# EAGLE design jetson_board (EAGLE 9.5.2)
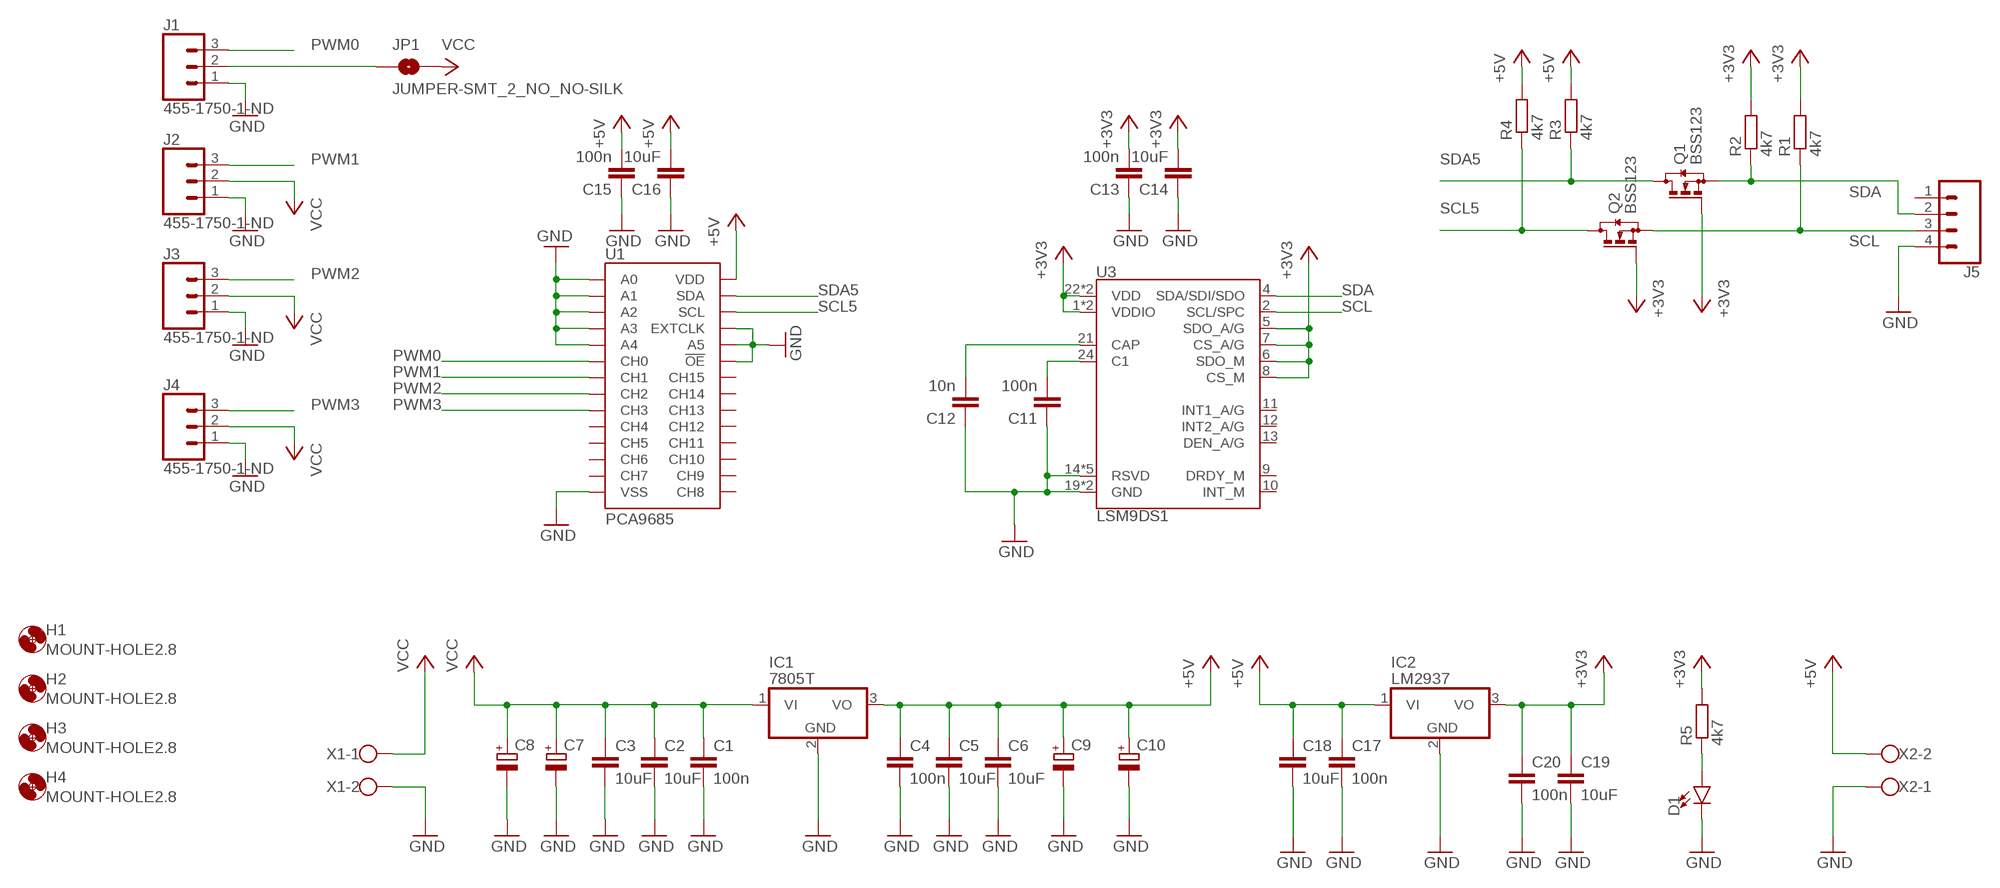
[diagram p0: schematic, sheet 1]

## Parts
C1  100n  C-EUC0805  [C0805]
C2  10uF  C-EUC0805  [C0805]
C3  10uF  C-EUC0805  [C0805]
C4  100n  C-EUC0805  [C0805]
C5  10uF  C-EUC0805  [C0805]
C6  10uF  C-EUC0805  [C0805]
C7  CPOL-EUUD-8X10  [UD-8X10_NICHICON]
C8  CPOL-EUUD-8X10  [UD-8X10_NICHICON]
C9  CPOL-EUUD-8X10  [UD-8X10_NICHICON]
C10  CPOL-EUUD-8X10  [UD-8X10_NICHICON]
C11  100n  C-EUC0805  [C0805]
C12  10n  C-EUC0805  [C0805]
C13  100n  C-EUC0805  [C0805]
C14  10uF  C-EUC0805  [C0805]
C15  100n  C-EUC0805  [C0805]
C16  10uF  C-EUC0805  [C0805]
C17  100n  C-EUC0805  [C0805]
C18  10uF  C-EUC0805  [C0805]
C19  10uF  C-EUC0805  [C0805]
C20  100n  C-EUC0805  [C0805]
D1  LED1206  [LED-1206]
H1  MOUNT-HOLE2.8  [2,8]
H2  MOUNT-HOLE2.8  [2,8]
H3  MOUNT-HOLE2.8  [2,8]
H4  MOUNT-HOLE2.8  [2,8]
IC1  7805T  [TO220H]
IC2  LM2937  [TO263-3]
J1  455-1750-1-ND  CONN_03  [1X03]
J2  455-1750-1-ND  CONN_03  [1X03]
J3  455-1750-1-ND  CONN_03  [1X03]
J4  455-1750-1-ND  CONN_03  [1X03]
J5  CONN_04LONGPADS  [1X04_LONGPADS]
JP1  JUMPER-SMT_2_NO_NO-SILK  [SMT-JUMPER_2_NO_NO-SILK]
Q1  BSS123  [SOT23]
Q2  BSS123  [SOT23]
R1  4k7  R-EU_R0805  [R0805]
R2  4k7  R-EU_R0805  [R0805]
R3  4k7  R-EU_R0805  [R0805]
R4  4k7  R-EU_R0805  [R0805]
R5  4k7  R-EU_R0805  [R0805]
U1  PCA9685  [TSSOP-28_4MM]
U3  LSM9DS1  [LGA-24-3.5X3]
X1  W237-102  [W237-102]
X2  W237-102  [W237-102]

## Nets
+3V3: C13.2 C14.2 C19.1 C20.1 IC2.3(VO) Q1.1(G) Q2.1(G) R1.2 R2.2 R5.2 U3.1(VDDIO) U3.3(VDDIO) U3.5(SDO_A/G) U3.6(SDO_M) U3.7(CS_A/G) U3.8(CS_M) U3.22(VDD) U3.23(VDD)
+5V: C4.1 C5.1 C6.1 C9.+ C10.+ C15.2 C16.2 C17.1 C18.1 IC1.3(VO) IC2.1(VI) R3.2 R4.2 U1.28(VDD) X2.2
GND: C1.2 C2.2 C3.2 C4.2 C5.2 C6.2 C7.- C8.- C9.- C10.- C11.1 C12.1 C13.1 C14.1 C15.1 C16.1 C17.2 C18.2 C19.2 C20.2 D1.C IC1.2(GND) IC2.2(GND) J1.1 J2.1 J3.1 J4.1 J5.4 U1.1(A0) U1.2(A1) U1.3(A2) U1.4(A3) U1.5(A4) U1.14(VSS) U1.23(!OE) U1.24(A5) U1.25(EXTCLK) U3.14(RSVD) U3.15(RSVD) U3.16(RSVD) U3.17(RSVD) U3.18(RSVD) U3.19(GND) U3.20(GND) X1.2 X2.1
N$1: J1.2 JP1.1
N$2: C11.2 U3.24(C1)
N$3: C12.2 U3.21(CAP)
N$4: D1.A R5.1
PWM0: J1.3 U1.6(CH0)
PWM1: J2.3 U1.7(CH1)
PWM2: J3.3 U1.8(CH2)
PWM3: J4.3 U1.9(CH3)
SCL: J5.3 Q2.2(S) R1.1 U3.2(SCL/SPC)
SCL5: Q2.3(D) R4.1 U1.26(SCL)
SDA: J5.2 Q1.2(S) R2.1 U3.4(SDA/SDI/SDO)
SDA5: Q1.3(D) R3.1 U1.27(SDA)
VCC: C1.1 C2.1 C3.1 C7.+ C8.+ IC1.1(VI) J2.2 J3.2 J4.2 JP1.2 X1.1
Unconnected: J5.1 U1.10(CH4) U1.11(CH5) U1.12(CH6) U1.13(CH7) U1.15(CH8) U1.16(CH9) U1.17(CH10) U1.18(CH11) U1.19(CH12) U1.20(CH13) U1.21(CH14) U1.22(CH15) U3.9(DRDY_M) U3.10(INT_M) U3.11(INT1_A/G) U3.12(INT2_A/G) U3.13(DEN_A/G)

## Library data of the parts
C1-C6 C11-C20 = rcl:C-EU: CAPACITOR, European symbol; SPICEPREFIX: C
C7-C10 = rcl:CPOL-EU: POLARIZED CAPACITOR, European symbol; SPICEPREFIX: C
D1 = SparkFun-LED:LED: LED (Generic) Standard schematic elements and footprints for 5mm, 3mm, 1206, and 0603 sized LEDs. Generic LEDs with no color specified.
H1-H4 = holes:MOUNT-HOLE: MOUNTING HOLE with drill center marker
IC1 = linear:78*: Positive VOLTAGE REGULATOR Source: http://cache.national.com/ds/LM/LM78L05.pdf http://www.fairchildsemi.com/ds/LM/LM7805.pdf
IC2 = linear:LM2937: LM2937-2.5, LM2937-3.3 400mA and 500mA Voltage Regulators Source: http://cache.national.com/ds/LM/LM2937-2.5.pdf
J1-J4 = SparkFun-Connectors:CONN_03: Multi connection point. Often used as Generic Header-pin footprint for 0.1 inch spaced/style header connections On any of the 0.1 inch spaced packages, you can populate with these: Break Away Headers - Straight <https://www.sparkfun.com/products/116> (PRT-00116) Break Away Male Headers - Right Angle <https://www.sparkfun.com/products/553> (PRT-00553) Female Headers <https://www.sparkfun.com/products/115> (PRT-00115) Break Away Headers - Machine Pin <https://www.sparkfun.com/products/117> (PRT-00117) Break Away Female Headers - Swiss Machine Pin <https://www.sparkfun.com/products/743> (PRT-00743) Stackable Header - 3 Pin (Female, 0.1") <https://www.sparkfun.com/products/13875> (PRT-13875) For SCREWTERMINALS and SPRING TERMINALS visit here: Screw Terimnals on SparkFun.com <https://www.sparkfun.com/search/results?term=Screw+Terminals> (5mm/3.5mm/2.54mm spacing) This device is also useful as a general connection point to wire up your design to another part of your project. Our various solder wires solder well into these plated through hole pads. Hook-Up Wire - Assortment (Stranded, 22 AWG) <https://www.sparkfun.com/products/11375> (PRT-11375) Hook-Up Wire - Assortment (Solid Core, 22 AWG) <https://www.sparkfun.com/products/11367> (PRT-11367) View the entire wire category on our website here <https://www.sparkfun.com/categories/141> Special notes: Molex polarized connector foot print use with SKU : PRT-08232 with associated crimp pins and housings.; PROD_ID: XXX-00000
J5 = SparkFun-Connectors:CONN_04: Multi connection point. Often used as Generic Header-pin footprint for 0.1 inch spaced/style header connections On any of the 0.1 inch spaced packages, you can populate with these: Break Away Headers - Straight <https://www.sparkfun.com/products/116> (PRT-00116) Break Away Male Headers - Right Angle <https://www.sparkfun.com/products/553> (PRT-00553) Female Headers <https://www.sparkfun.com/products/115> (PRT-00115) Break Away Headers - Machine Pin <https://www.sparkfun.com/products/117> (PRT-00117) Break Away Female Headers - Swiss Machine Pin <https://www.sparkfun.com/products/743> (PRT-00743) For SCREWTERMINALS and SPRING TERMINALS visit here: Screw Terimnals on SparkFun.com <https://www.sparkfun.com/search/results?term=Screw+Terminals> (5mm/3.5mm/2.54mm spacing) This device is also useful as a general connection point to wire up your design to another part of your project. Our various solder wires solder well into these plated through hole pads. Hook-Up Wire - Assortment (Stranded, 22 AWG) <https://www.sparkfun.com/products/11375> (PRT-11375) Hook-Up Wire - Assortment (Solid Core, 22 AWG) <https://www.sparkfun.com/products/11367> (PRT-11367) View the entire wire category on our website here <https://www.sparkfun.com/categories/141> Special notes: Molex polarized connector foot print use with SKU : PRT-08231 with associated crimp pins and housings. 1MM SMD Version SKU: PRT-10208; PROD_ID: CONN-09696
JP1 = SparkFun-Jumpers:JUMPER-SMT_2_NO: Normally open jumper This jumper has two pads in close proximity to each other. Apply solder to close the connection. Round pads are easier to solder for beginners, but are a lot larger. SparkFun Product that uses the round pads: SparkFun EL Sequencer <https://www.sparkfun.com/products/12781>
Q1 Q2 = transistor-small-signal:BSS123: N-CHANNEL MOS FET
R1-R5 = rcl:R-EU_: RESISTOR, European symbol; SPICEPREFIX: R
U1 = SparkFun-IC-Special-Function:PCA9685: 16-channel 12-bit PWM I2C interface Internal Oscillator 40Hz to 1kHz Can be totem pole or open collector 2.3V to 5.5V SparkFun Products SparkFun Block for Intel® Edison - PWM <https://www.sparkfun.com/products/13042> (DEV-13042) PROTO: IC-12240 PROD_ID: IC-12271; PROD_ID: IC-12271
U3 = SparkFun-Sensors:LSM9DS1: ST Microelectronics LSM9DS1 9DOF IMU - Accelerometer, Gyroscope & Magnetometer The LSM9DS1 is a versatile, motion-sensing system-in-a-chip. It houses a 3-axis accelerometer, 3-axis gyroscope, and 3-axis magnetometer – nine degrees of freedom (9DOF) in a single IC! The LSM9DS1 is equipped with a digital interface, but even that is flexible: it supports both I2C and SPI, so you’ll be hard-pressed to find a microcontroller it doesn’t work with. Datasheet <https://cdn.sparkfun.com/assets/learn_tutorials/3/7/3/LSM9DS1_Datasheet.pdf> SparkFun Products SparkFun 9 Degrees of Freedom IMU Breakout - LSM9DS1 <https://www.sparkfun.com/products/13284> (SEN-13284) SparkFun Photon IMU Shield <https://www.sparkfun.com/products/13629> (DEV-13629); PROD_ID: IC-12536
X1 X2 = con-wago-500:W237-102: WAGO SCREW CLAMP; MPN: 237-102; OC_FARNELL: unknown; OC_NEWARK: 70K9898

## Board
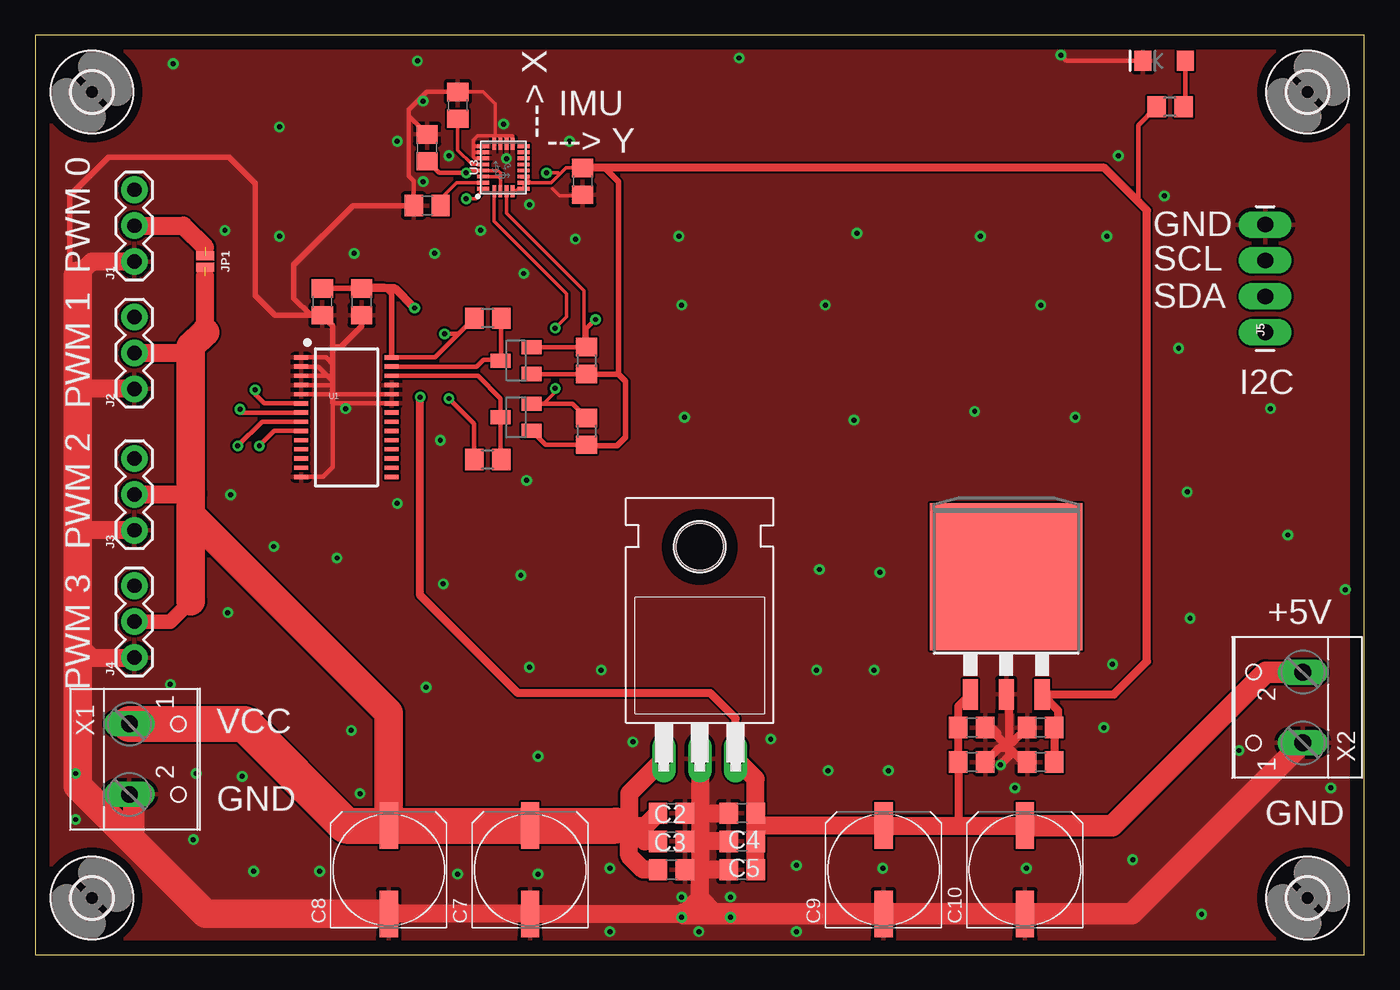
[diagram p1: board, top side]
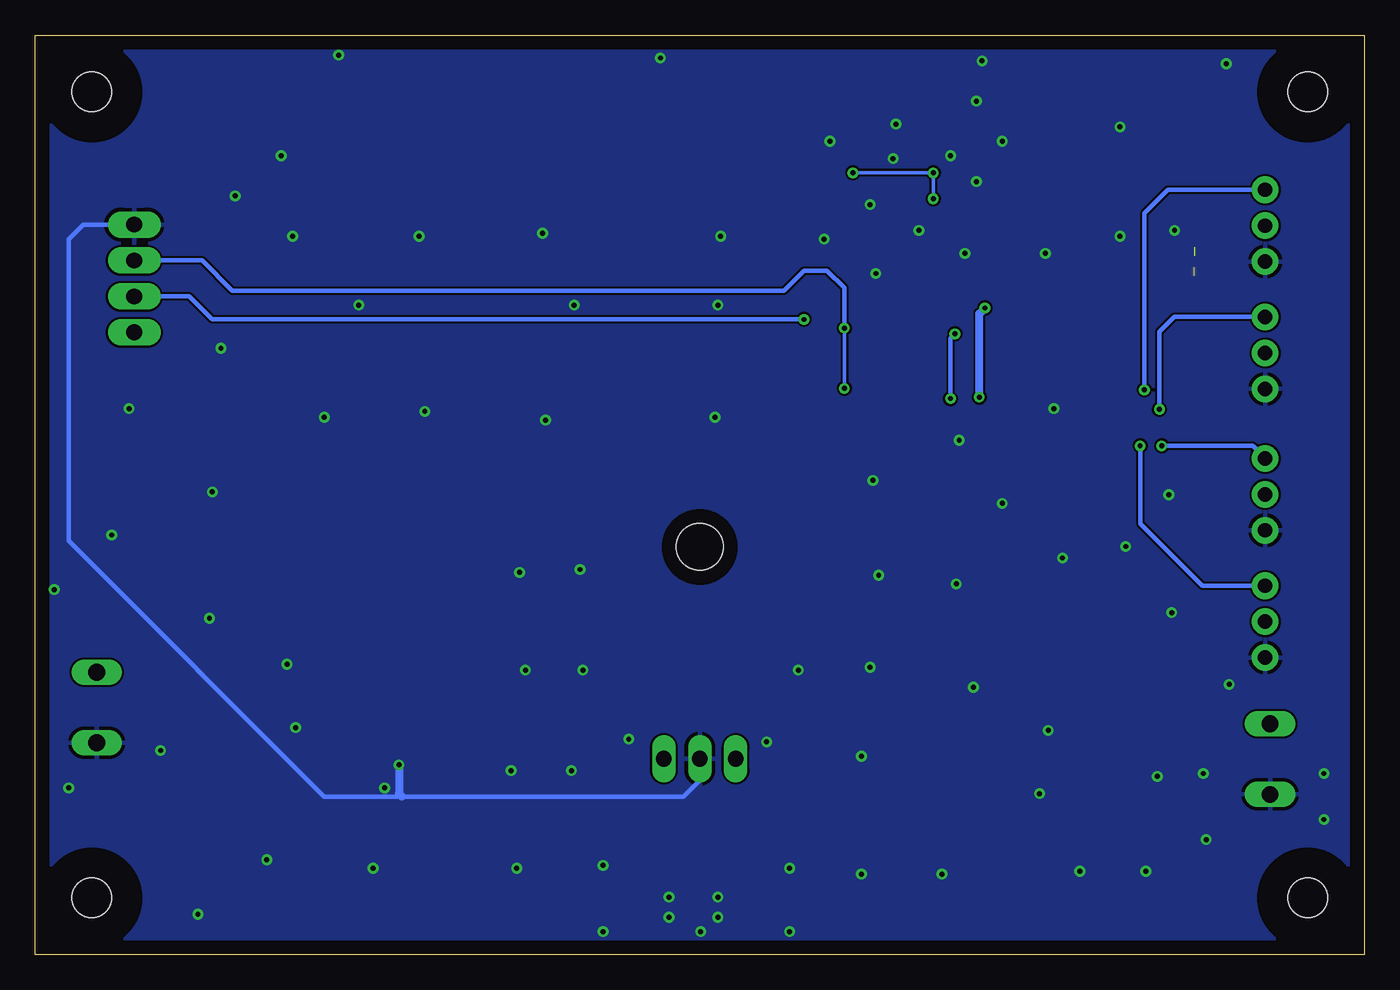
[diagram p2: board, bottom side, seen from below]

Size 94 x 65 mm. Coordinates in mm from the lower left corner, seen from the top.
Outline: 0,0 94,0 94,65 0,65 0,0
Copper layers (1*16): Top 0.035mm / dielectric 1.5mm / Bottom 0.035mm
Design rules "default": minimum track width 6mil, minimum drill 0.35mm, track to track 6mil, track to pad 6mil, pad to pad 6mil, via to via 6mil, smd to smd 6mil, copper to edge 40mil, drill to drill 6mil, minimum pad ring 10mil, minimum via ring 8mil, stop-mask expansion 4mil, vias tented up to drill 0mil, thermal gap 10mil

### Footprints (pad centres in the part's own frame; a part is rotated, then mirrored left to right if it is on the bottom)
C0805 = smd 1.3 x 1.5: 1 -0.95,0; 2 0.95,0
UD-8X10_NICHICON = smd 3.3 x 1.3: + 3.125,0; - -3.125,0
LED-1206 = smd 1.2 x 1.4: A -1.5,0; C 1.5,0
2,8 = hole 2.8: 0,0
TO220H = drill 1.118 long: 1 -2.54,-10.16; 2 0,-10.16; 3 2.54,-10.16 | hole 3.302: 0,4.826
TO263-3 = smd 1.067 x 2.159: 1 -2.54,-5.791; 2 0,-5.791; 3 2.54,-5.791 | smd 10.8 x 10.41: TAB 0,2.54
1X03 = drill 1.016 pad 1.88: 1 0,0; 2 2.54,0; 3 5.08,0
1X04_LONGPADS = drill 1.118 pad 1.88 long: 1 0,0; 2 2.54,0; 3 5.08,0; 4 7.62,0
SMT-JUMPER_2_NO_NO-SILK = smd 0.635 x 1.27: 1 -0.406,0; 2 0.406,0
SOT23 = smd 1 x 1.4: 1 -0.95,-1.1; 2 0.95,-1.1; 3 0,1.1
R0805 = smd 1.3 x 1.5: 1 -0.95,0; 2 0.95,0
TSSOP-28_4MM = smd 1 x 0.3: 1 -3.2,4.225; 2 -3.2,3.575; 3 -3.2,2.925; 4 -3.2,2.275; 5 -3.2,1.625; 6 -3.2,0.975; 7 -3.2,0.325; 8 -3.2,-0.325; 9 -3.2,-0.975; 10 -3.2,-1.625; 11 -3.2,-2.275; 12 -3.2,-2.925; 13 -3.2,-3.575; 14 -3.2,-4.225; 15 3.2,-4.225; 16 3.2,-3.575; 17 3.2,-2.925; 18 3.2,-2.275; 19 3.2,-1.625; 20 3.2,-0.975; 21 3.2,-0.325; 22 3.2,0.325; 23 3.2,0.975; 24 3.2,1.625; 25 3.2,2.275; 26 3.2,2.925; 27 3.2,3.575; 28 3.2,4.225
LGA-24-3.5X3 = smd 0.27 x 0.85: 1 -1.505,1.425; 6 -1.505,-1.425; 7 -1.075,-1.425; 8 -0.645,-1.425; 9 -0.215,-1.425; 10 0.215,-1.425; 11 0.645,-1.425; 12 1.075,-1.425; 13 1.505,-1.425; 18 1.505,1.425; 19 1.075,1.425; 20 0.645,1.425; 21 0.215,1.425; 22 -0.215,1.425; 23 -0.645,1.425; 24 -1.075,1.425 | smd 0.85 x 0.27: 2 -1.675,0.645; 3 -1.675,0.215; 4 -1.675,-0.215; 5 -1.675,-0.645; 14 1.675,-0.645; 15 1.675,-0.215; 16 1.675,0.215; 17 1.675,0.645
W237-102 = drill 1.194 long: 1 -2.5,-1.27; 2 2.5,-1.27

### Placement (x,y rotation side)
C1  45,10 0 top
C2  45,8 0 top
C3  45,6 0 top
C4  50,10 180 top
C5  50,8 180 top
C6  50,6 180 top
C7  35,6 90 top
C8  25,6 90 top
C9  60,6 90 top
C10  70,6 90 top
C11  27.72,52.96 0 top
C12  29.88,60.05 270 top
C13  27.72,57.05 270 top
C14  38.72,54.68 90 top
C15  23.09,46.15 90 top
C16  20.3,46.15 90 top
C17  66.24,16.05 0 top
C18  66.24,13.61 0 top
C19  71.12,13.61 180 top
C20  71.12,16.05 180 top
D1  79.86,63.2 180 top
H1  4,4 0 top
H2  90,4 0 top
H3  4,61 0 top
H4  90,61 0 top
IC1  47,24 0 top
IC2  68.68,24.18 0 top
J1  7,49 90 top
J2  7,40 90 top
J3  7,30 90 top
J4  7,21 90 top
J5  87,44 90 top
JP1  12,49 270 top
Q1  34,42 90 top
Q2  34,38 90 top
R1  39,37 270 top
R2  39,42 270 top
R3  32,45 180 top
R4  32,35 180 top
R5  80.26,59.94 180 top
U1  22,38 0 top
U3  33.11,55.66 90 top
X1  7.92,13.82 270 top
X2  88.39,17.48 90 top

### Tracks (layer width: path | path; a pad name or v marks a point on that pad's centre or on a via)
+3V3  (via drill 0.35)
  Top 0.203: U3.7 U3.6 34.3,54.18 U3.5
  Top 0.254: U3.7 35.04,54.58 | 35.04,54.58 36.5,54.58 37.08,55.17 | C14.2 38.61,55.63 37.55,55.63 37.08,55.17 | U3.8 34.4,54.95 34.67,54.95 35.04,54.58 | U3.3 32.89,54.86 | 32.89,54.86 32.89,55.3 32.75,55.44 | 32.75,55.44 32.72,55.47 | U3.23 32.74,55.01 32.89,54.86 | 32.75,55.44 U3.22 30.65,55.44 v30.48,55.27 | v36.17,55.27 36.98,55.27 37.08,55.17 | U3.1 31.17,53.44 v30.48,53.44
  Top 0.305: R2.2 Q1.1 | R1.2 36.1,36.05 Q2.1 | v30.48,55.27 28.55,55.27 C13.2 | R5.2 78.03,58.66 78.03,53.24
  Top 0.406: R2.2 41.25,41.05 | 41.25,41.05 41.76,40.54 41.76,36.58 41.15,35.97 39.08,35.97 R1.2 | C14.2 40.28,55.63 41.25,54.66 41.25,41.05
  Top 0.559: C19.1 C20.1 72.34,16.32 72.34,17.27 IC2.3 76.3,18.39 78.64,20.73 78.64,52.63 78.03,53.24 75.64,55.63 38.61,55.63
  Bottom 0.254: v36.17,55.27 v30.48,55.27 v30.48,53.44
+5V  (via drill 0.35)
  Top 0.305: U1.28 28.27,42.23 29.91,43.86 | 29.91,43.86 R3.2 | R4.2 31.05,37.53 v29.26,39.32 | v28.96,43.89 29.87,43.89 29.91,43.86
  Top 0.406: C16.2 C15.2 23.23,47.24 24.69,47.24 25.2,46.73 U1.28
  Top 0.559: IC1.3 49.54,16.7 47.75,18.49 34.14,18.49 27.23,25.4 v27.23,39.42 | v26.82,45.72 25.44,47.1 C15.2 | IC2.1 65.29,17.54 C17.1 C18.1 65.29,9.19 65.23,9.12
  Top 1.27: C6.1 C5.1 50.95,9 | 50.95,9 C4.1 50.95,12.43 IC1.3 | 50.95,9 51.08,9.12 C9.+ 65.23,9.12 C10.+
  Top 1.524: C10.+ 76.18,9.12 87.03,19.98 X2.2
  Bottom 0.305: v29.26,39.32 29.26,43.59 v28.96,43.89
  Bottom 0.559: v27.23,39.42 27.23,45.31 v26.82,45.72
GND  (via drill 0.35)
  Top 0.254: 36.58,54.15 37.08,53.65 38.63,53.65 C14.1 | U3.17 32.46,57.86 32.51,57.91 | U3.14 33.75,57.89 33.73,57.91 33.43,57.91 | 33.43,57.91 32.82,57.91 | 32.82,57.91 32.51,57.91 | U3.16 32.89,57.84 32.82,57.91 | U3.15 33.32,57.81 33.43,57.91 | U3.20 31.07,56.3 30.99,56.39 30.99,56.69 | 30.99,56.69 30.99,57.3 | 30.99,57.3 30.99,57.61 31.29,57.91 32.51,57.91 | U3.18 31.13,57.16 30.99,57.3 | U3.19 31.03,56.73 30.99,56.69 | C12.1 31.66,61 32.51,60.15 32.51,57.91
  Top 0.305: U1.14 20.36,33.77 21.03,34.44 21.03,39.01 | 21.03,40.54 21.03,40.23 | 21.03,40.23 21.03,39.62 | 21.03,39.62 21.03,39.01 | U1.2 20,41.58 21.03,40.54 | U1.5 21.03,39.62 | 21.03,39.62 | U1.4 20.99,40.27 21.03,40.23 | U1.1 20.56,42.23 21.03,41.76 21.03,40.84 | 21.03,40.84 21.03,40.54 | U1.3 20.95,40.92 21.03,40.84 | U1.24 21.03,39.62 | U1.23 21.07,38.98 21.03,39.01 | C11.1 26.77,54.72 26.42,55.07 26.42,59.3 | C12.1 27.67,61 26.42,59.74 26.42,59.3 | C13.1 26.42,59.3 | D1.C 72.95,63.2 v72.54,63.6
  Top 0.406: 21.03,42.98 21.03,44.48 C16.1 19.51,45.2 | 21.03,42.98 21.03,39.01 | C15.1 23.09,44.42 21.64,42.98 21.03,42.98 | 19.51,45.2 16.98,45.2 15.54,46.63 15.54,54.56 13.72,56.39 5.18,56.39 2.44,53.65 2.44,48.56 3,48 | 47,10.06 47.19,10.06 47.24,10 | C11.1 22.48,52.96 18.29,48.77 18.29,46.42 19.51,45.2
  Top 0.559: IC2.2 68.89,18.19 68.89,15.04 | 68.89,15.04 68.89,14.63 | C18.2 68.21,14.63 68.89,14.63 | 68.89,14.63 68.07,15.44 68.07,15.65 67.67,16.05 C17.2 | C20.2 69.15,15.04 68.89,15.04 | C19.2 69.9,13.61 68.89,14.63 | 68.89,14.63 68.89,14.02 v68.28,13.41
  Top 1.27: C1.2 47.24,10 C4.2 | IC1.2 47,10.06 47,8 | 47,8 47,6 | 47,6 C3.2 | C2.2 47,8 | C5.2 47,8 | C6.2 47,6 | 47,4 45.88,2.88 C7.- C8.- | 47,4 47,6 | 47,4 48.12,2.88 C9.- C10.- | J1.1 4,49 3,48 3,40 | 3,40 3,30 | 3,30 3,22 4,21 J4.1 | J3.1 3,30 | J2.1 3,40
  Top 1.524: X1.2 6.96,11.01 6.96,7.98 | X2.1 77.56,2.88 45.88,2.88
  Top 2.032: C8.- 12.06,2.88 6.96,7.98 3,11.94 3,48
  Bottom 0.305: IC1.2 47,12.33 48.16,11.18 68.07,11.18 73.56,11.18 91.64,29.26 91.64,50.6 90.62,51.62 J5.4
  Bottom 0.559: 68.07,11.18 68.28,11.38 v68.28,13.41
  other vias: 56.08,13 60.35,13 40.64,6.1 53.85,6.3 59.94,6.1 29.87,5.69 20.12,5.89 70.1,6.1 9.55,19.1 13.61,24.18 22.35,15.85 13.82,32.51 27.64,18.9 21.34,28.04 34.34,26.82 35.56,14.02 55.47,27.23 59.74,27.03 40.03,20.12 22.56,49.58 28.24,49.58 38.2,50.6 9.75,62.99 49.78,63.4 27.03,63.2 75.79,50.8 45.52,50.8 45.92,38 73.56,38 34.75,33.53 28.65,36.37 17.27,50.8 13.41,51.21 57.91,37.8 58.12,51 66.85,50.8 66.45,38.4 82.5,2.84 91.64,11.79 88.6,29.67 81.69,23.77 87.38,38.61 59.33,20.12 55.27,20.12 69.29,11.79 46.94,1.63 40.64,1.63 53.85,1.63 25.6,31.9 15.44,5.89 11.18,8.13 11.38,12.8 35.56,5.69 77.62,6.71 85.14,14.43 75.59,16.05 92.66,25.81 81.48,32.72 21.95,38.61 16.87,28.85 28.85,26.21 34.95,20.32 55.88,45.92 45.72,45.92 71.12,45.92 22.96,11.38 14.63,12.6 42.27,15.04 52.02,15.24 45.72,4.06 49.17,4.06 45.72,2.64 49.17,2.64 31.5,51.21 34.54,48.16 27.43,60.35 33.12,58.72 34.95,53.04 37.8,57.51 27.43,54.66 33.32,56.29 29.26,56.49 25.6,57.51 17.27,58.52 2.84,9.55 2.84,12.8 80.87,42.88 79.86,53.64 76.61,56.49 76.2,20.52
  pour Bottom: -3.05,68.68 97.13,68.68 97.13,-5.89 -3.05,-5.89
  pour Top: -3.25,69.09 104.44,69.09 104.44,-21.13 -3.25,-21.13
N$1  (1 unrouted)
  Top 1.27: J1.2 10.46,51.54 12,50
N$2
  Top 0.254: U3.24 29.79,54.58 28.67,53.46 C11.2
N$3
  Top 0.254: U3.21 30.89,55.87 29.88,56.88 C12.2
N$4
  Top 0.305: D1.A 81.36,60.09 R5.1
PWM0  (via drill 0.35)
  Top 0.305: U1.6 16.19,38.98 15.54,39.62 v15.54,39.93
  Bottom 0.305: v15.54,39.93 15.54,52.43 13.89,54.08 J1.3
PWM1  (via drill 0.35)
  Top 0.305: U1.7 14.4,38.33 14.33,38.41 v14.48,38.56
  Bottom 0.305: v14.48,38.56 14.48,44.04 13.41,45.11 7.03,45.11 J2.3
PWM2  (via drill 0.35)
  Top 0.305: U1.8 16.03,37.67 v14.33,35.97
  Bottom 0.305: v14.33,35.97 7.89,35.97 J3.3
PWM3  (via drill 0.35)
  Top 0.305: U1.9 16.91,37.02 v15.85,35.97
  Bottom 0.305: J4.3 11.45,26.08 15.85,30.48 v15.85,35.97
SCL  (via drill 0.35)
  Top 0.254: v36.78,44.3 37.59,45.11 37.59,46.74 32.46,51.86 U3.2 | v36.78,40.03 36.78,39.76 35.97,38.95
  Top 0.305: Q2.2 35.97,38.95 38,38.95 R1.1
  Bottom 0.254: v36.78,44.3 v36.78,40.03
  Bottom 0.305: J5.3 82.2,49.08 80.06,46.94 41.05,46.94 39.62,48.36 38,48.36 36.78,47.14 v36.78,44.3
SCL5
  Top 0.305: U1.26 31.31,40.92 32.92,39.32 32.92,38.02 Q2.3 32.9,35.05 R4.1
SDA  (via drill 0.35)
  Top 0.254: U3.4 33.32,52.43 38.81,46.94 38.81,42.95
  Top 0.305: Q1.2 38.81,42.95 R2.1 39,44.28 v39.62,44.91
  Bottom 0.305: v39.62,44.91 81.48,44.91 83.12,46.54 J5.2
SDA5
  Top 0.305: U1.27 31.21,41.58 31.7,42.06 32.84,42.06 Q1.3 32.95,42.05 R3.1
VCC  (1 unrouted)
  Top 1.016: J4.2 9.54,23.54 11,25 | J3.2 10.93,32.54 11,32.61
  Top 1.27: J2.2 10.54,42.54 12,44 12,48 | J3.2 10.46,32.54 | C8.+ C7.+ 41.05,9.12 42,9.12 | 42,9.12 43.17,9.12 C1.1 | IC1.1 42,11.38 42,9.12 | C2.1 43.12,8 42,9.12 | C3.1 43,6 42,7 42,9.12
  Top 2.032: 11,31.09 25,17.09 C8.+ | 11,31.09 11,32.61 11,43 12,44 | 11,25 11,31.09
  Top 2.54: X1.1 14.77,16.32 21.96,9.12 41.05,9.12

### Text on the board
tNames: IMU | ---> X | ---> Y | GND | PWM 0 | SCL | SDA | I2C | PWM 1 | PWM 2 | +5V | PWM 3 | VCC | GND | GND